# Altium schematic sheet MainBoard.SchDoc
size A4
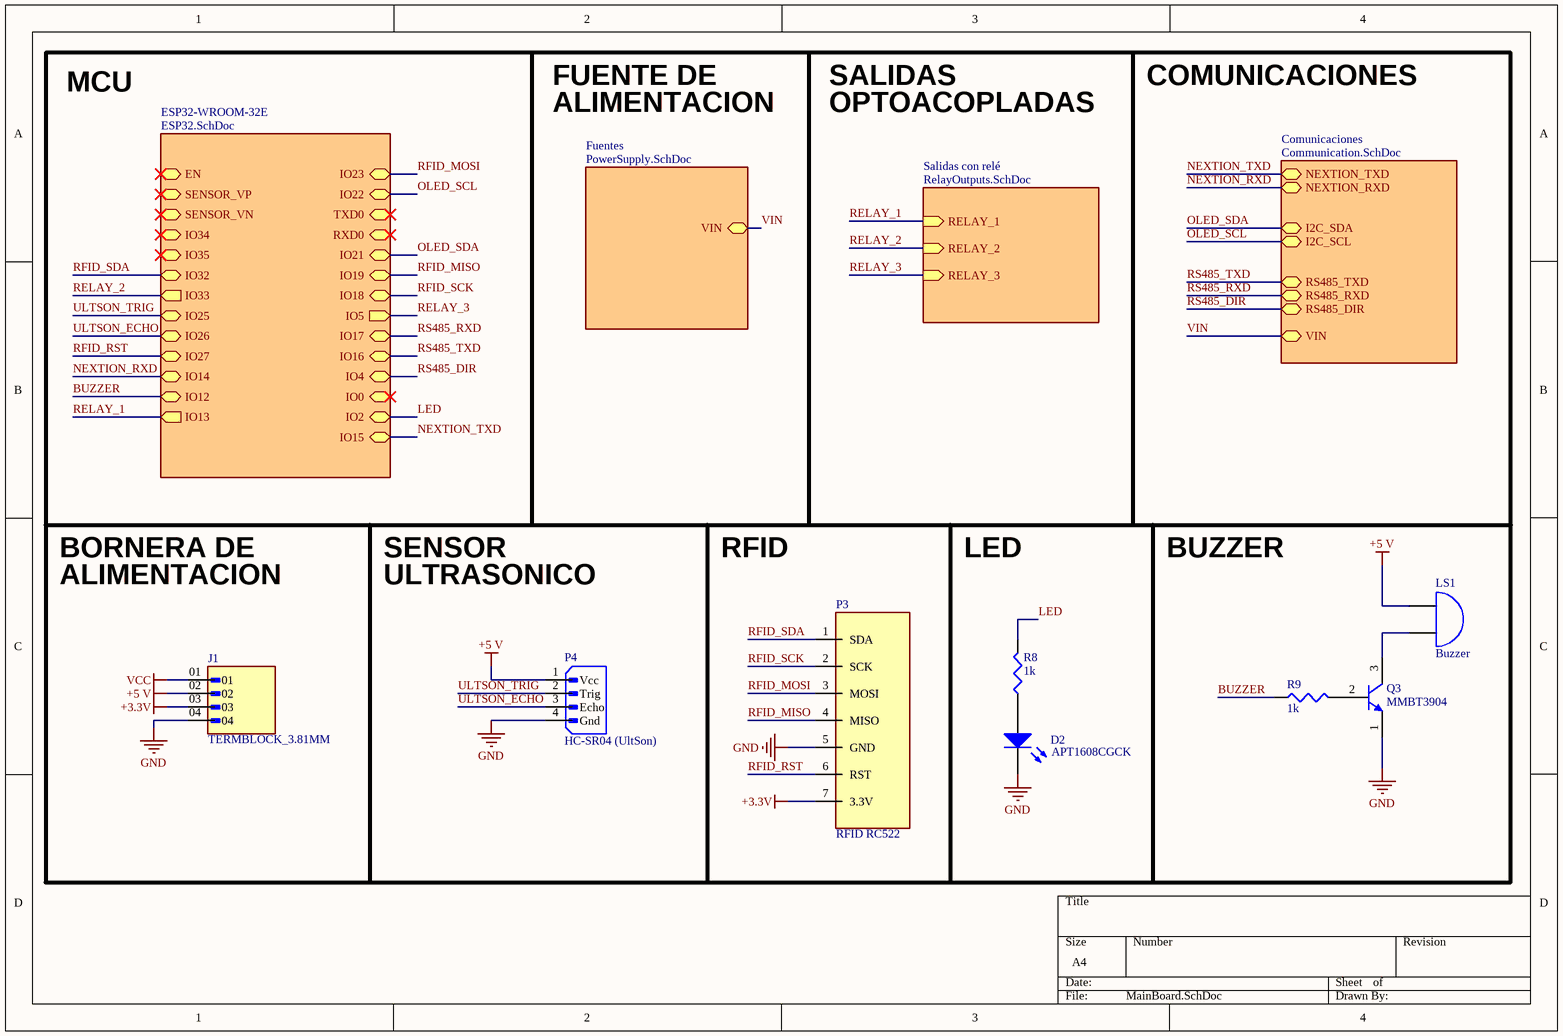
[diagram p0: MainBoard.SchDoc]

## Parts
D2  APT1608CGCK  [ChipDiode1608]
J1  TERMBLOCK_3.81MM  [TERMBLOCK_3.81MM_90DEG_4POS]
LS1  Buzzer  [BUZZER]
P3  RFID RC522  [MOD_RFID_RC522]
P4  HC-SR04 (UltSon)  [CONN-B4B-XH-A]
Q3  MMBT3904  [MMBT3904]
R8  1k  [RESC2012N]
R9  1k  [RESC2012N]

## Sub-sheets
Comunicaciones = Communication.SchDoc: RS485_TXD, RS485_RXD, NEXTION_TXD, I2C_SDA, I2C_SCL, NEXTION_RXD, RS485_DIR, VIN
ESP32-WROOM-32E = ESP32.SchDoc: SENSOR_VN, IO34, SENSOR_VP, IO35, IO32, IO33 (out), IO25, IO26, IO27, IO14, IO12, IO13 (out), IO22, TXD0, RXD0, IO15, IO23, IO21, IO19, IO18, IO5 (out), IO17, IO16, IO4, IO0, IO2, EN
Fuentes = PowerSupply.SchDoc: VIN
Salidas con relé = RelayOutputs.SchDoc: RELAY_2 (in), RELAY_1 (in), RELAY_3 (in)

## Nets
+3.3V: J1.03 P3.7(3.3V)
+5 V: J1.02 LS1.1(A) P4.1(Vcc)
GND: D2.2(K) J1.04 P3.5(GND) P4.4(Gnd) Q3.1(E)
VCC: J1.01
BUZZER: R9.1 ; sheet ESP32-WROOM-32E/IO12
LED: R8.2 ; sheet ESP32-WROOM-32E/IO2
NEXTION_RXD: sheet ESP32-WROOM-32E/IO14, sheet Comunicaciones/NEXTION_RXD
NEXTION_TXD: sheet ESP32-WROOM-32E/IO15, sheet Comunicaciones/NEXTION_TXD
OLED_SCL: sheet ESP32-WROOM-32E/IO22, sheet Comunicaciones/I2C_SCL
OLED_SDA: sheet ESP32-WROOM-32E/IO21, sheet Comunicaciones/I2C_SDA
RELAY_1: sheet ESP32-WROOM-32E/IO13, sheet Salidas con relé/RELAY_1
RELAY_2: sheet ESP32-WROOM-32E/IO33, sheet Salidas con relé/RELAY_2
RELAY_3: sheet ESP32-WROOM-32E/IO5, sheet Salidas con relé/RELAY_3
RFID_MISO: P3.4(MISO) ; sheet ESP32-WROOM-32E/IO19
RFID_MOSI: P3.3(MOSI) ; sheet ESP32-WROOM-32E/IO23
RFID_RST: P3.6(RST) ; sheet ESP32-WROOM-32E/IO27
RFID_SCK: P3.2(SCK) ; sheet ESP32-WROOM-32E/IO18
RFID_SDA: P3.1(SDA) ; sheet ESP32-WROOM-32E/IO32
RS485_DIR: sheet ESP32-WROOM-32E/IO4, sheet Comunicaciones/RS485_DIR
RS485_RXD: sheet ESP32-WROOM-32E/IO17, sheet Comunicaciones/RS485_RXD
RS485_TXD: sheet ESP32-WROOM-32E/IO16, sheet Comunicaciones/RS485_TXD
ULTSON_ECHO: P4.3(Echo) ; sheet ESP32-WROOM-32E/IO26
ULTSON_TRIG: P4.2(Trig) ; sheet ESP32-WROOM-32E/IO25
VIN: sheet Fuentes/VIN, sheet Comunicaciones/VIN
NetD2_1: D2.1(A) R8.1
NetLS1_2: LS1.2(B) Q3.3(C)
NetQ3_2: Q3.2(B) R9.2

## Notes on the sheet
- MCU
- FUENTE DE
- ALIMENTACION
- SALIDAS
- OPTOACOPLADAS
- COMUNICACIONES
- BORNERA DE
- SENSOR
- RFID
- LED
- BUZZER
- ULTRASONICO

## Library data of the parts
D2 = LED2: LED 1.6x0.8 mm 570 nm GRN CLR SMD; Published: 8-Jun-2000; LatestRevisionDate: 17-Jul-2002; LatestRevisionNote: Re-released for DXP Platform.; PackageVersion: Feb-2002; PackageReference: 3.2X1.6X1.1; Publisher: Altium Limited; PackageDescription: SM LED; 2 Flat Leads
J1 = TERMBLOCK_3.81MM_90DEG_4POS: TERMBLOCK_3.81MM_90DEG_4POS (DigiKey: 1803293)
LS1 = Bell: Electrical Bell; Published: 24-Mar-1999; LatestRevisionDate: 17-Jul-2002; LatestRevisionNote: Re-released for DXP Platform.; PackageReference: PIN2; Publisher: Altium Limited
P3 = MOD_RFID_RC522: Módulo RFID RC522 con conector B7B-XH-A
P4 = CONN-B4B-XH-A: B4B-XH-A - CONN HEADER VERT 4POS 2.5MM
Q3 = MMBT3904: TRANS NPN 40V 0.2A SOT-23-3
R8 R9 = Res3: Resistor; Published: 8-Jun-2000; LatestRevisionDate: 29-May-2009; LatestRevisionNote: IPC-7351 Footprint Added.; PackageReference: J1-0603; Publisher: Altium Limited; PackageDescription: Chip Resistor
  R8: Value: 1K
  R9: Value: 1k